# EAGLE schematic controller-ha-v3 (EAGLE 6.5.0)
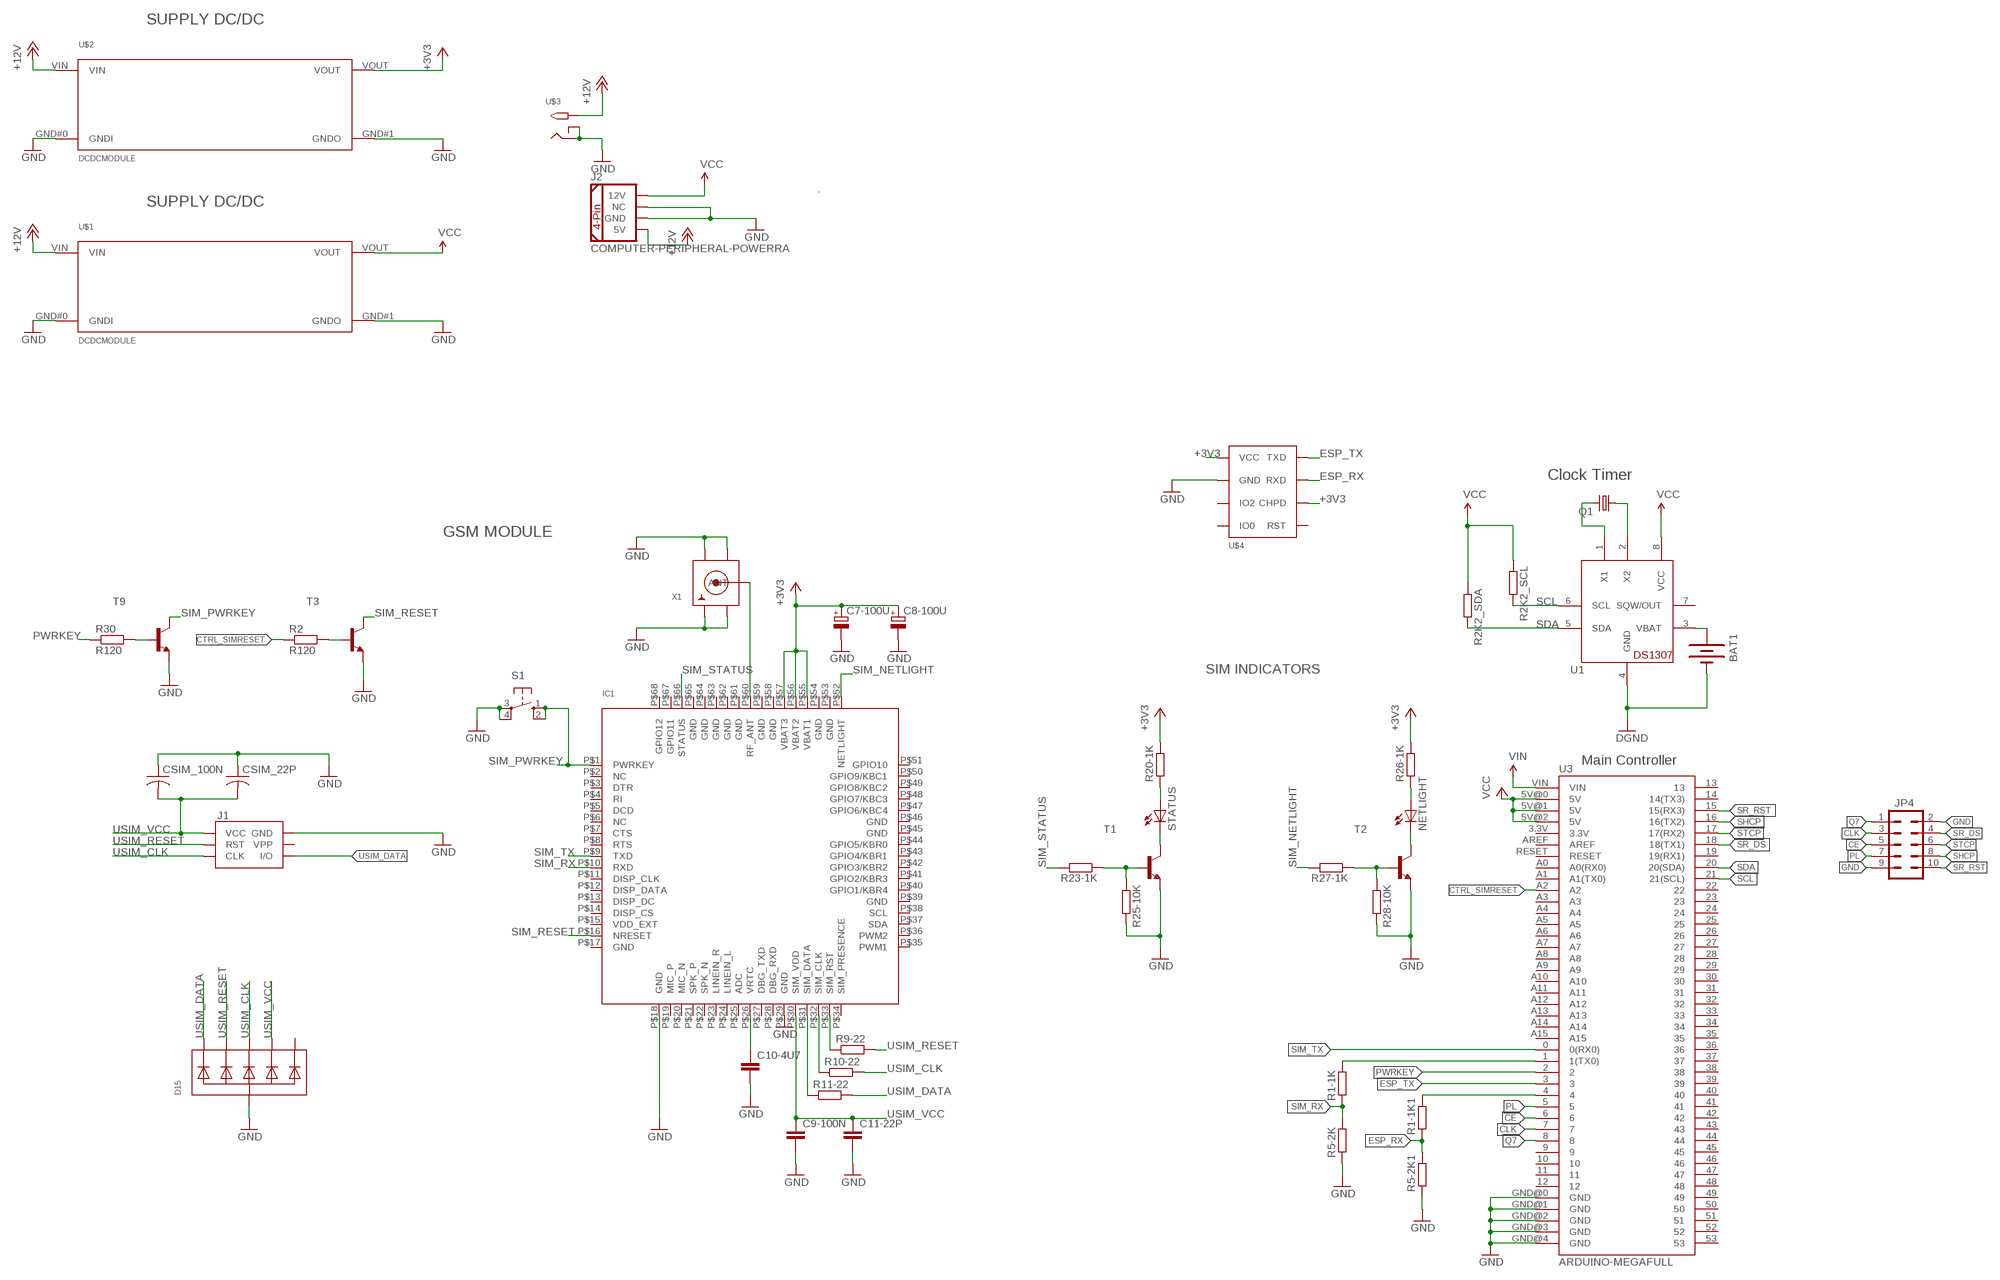
[diagram p0: schematic, sheet 1]

## Parts
BAT1  BATTERY20PTH  [BATTCOM_20MM_PTH]
C7-100U  CPOL-EU153CLV-0605  [153CLV-0605]
C8-100U  CPOL-EU153CLV-0605  [153CLV-0605]
C9-100N  C-EUC0603  [C0603]
C10-4U7  C-EUC0603  [C0603]
C11-22P  C-EUC0603  [C0603]
CSIM_22P  C-USC0603K  [C0603K]
CSIM_100N  C-USC0603K  [C0603K]
D15  TVSARRAY_5LANE  [SOT363]
IC1  GSM_SIM900_LITERAL  [SIM900_SMT]
J1  SIMHOLDERSIM  [SIMHOLDER]
J2  COMPUTER-PERIPHERAL-POWERRA  [COMPUTER-PERIPHERAL-POWER-RA]
JP4  M05X2RA  [2X5-RA]
NETLIGHT  LEDCHIP-LED0805  [CHIP-LED0805]
Q1  CRYSTALTC26H  [TC26H]
R1-1K  R-EU_R0603  [R0603]
R1-1K1  R-EU_R0603  [R0603]
R2  R120  R-EU_M0805  [M0805]
R2K2_SCL  R-EU_R0603  [R0603]
R2K2_SDA  R-EU_R0603  [R0603]
R5-2K  R-EU_R0603  [R0603]
R5-2K1  R-EU_R0603  [R0603]
R9-22  R-EU_R0603  [R0603]
R10-22  R-EU_R0603  [R0603]
R11-22  R-EU_R0603  [R0603]
R20-1K  R-EU_R0603  [R0603]
R23-1K  R-EU_R0603  [R0603]
R25-10K  R-EU_R0603  [R0603]
R26-1K  R-EU_R0603  [R0603]
R27-1K  R-EU_R0603  [R0603]
R28-10K  R-EU_R0603  [R0603]
R30  R120  R-EU_M0805  [M0805]
S1  10-XX  [B3F-10XX]
STATUS  LEDCHIP-LED0805  [CHIP-LED0805]
T1  MMBT2222ALT1-NPN-SOT23-BEC  [SOT23-BEC]
T2  MMBT2222ALT1-NPN-SOT23-BEC  [SOT23-BEC]
T3  MMBT2222ALT1-NPN-SOT23-BEC  [SOT23-BEC]
T9  MMBT2222ALT1-NPN-SOT23-BEC  [SOT23-BEC]
U1  DS1307  [DIL08]
U3  ARDUINO-MEGAFULL  [ARDUINO_MEGA]
U$1  DCDCMODULE  [DCDCMODULE]
U$2  DCDCMODULE  [DCDCMODULE]
U$3  2.1MMJACKTHM  [PJ-102A]
U$4  ESP8266  [ESP8266]
X1  SMACONNECTOR  [SMA90_DIP]

## Nets
+3V3: C7-100U.+ C8-100U.+ IC1.P$55(VBAT1) IC1.P$56(VBAT2) IC1.P$57(VBAT3) R20-1K.2 R26-1K.2 U$2.VOUT U$4.CHPD U$4.VCC
+12V [GND]: J2.5V U$1.VIN U$2.VIN U$3.TIP
CE: JP4.5 U3.6
CLK: JP4.3 U3.7
CTRL_SIMRESET: R2.1 U3.A2
ESP_RX: R1-1K1.1 R5-2K1.2 U$4.RXD
ESP_TX: U3.3 U$4.TXD
GND [GND]: BAT1.2(-) C7-100U.- C8-100U.- C9-100N.2 C10-4U7.2 C11-22P.2 CSIM_22P.1 CSIM_100N.1 D15.2(A) IC1.P$18(GND) IC1.P$29(GND) J1.C5(GND) J2.GND J2.NC JP4.2 JP4.9 R5-2K1.1 R5-2K.1 R25-10K.2 R28-10K.2 S1.3(P) S1.4(P1) T1.E T2.E T3.E T9.E U1.4(GND) U3.GND@0(GND) U3.GND@1(GND) U3.GND@2(GND) U3.GND@3(GND) U3.GND@4(GND) U$1.GND#0(GNDI) U$1.GND#1(GNDO) U$2.GND#0(GNDI) U$2.GND#1(GNDO) U$3.RING U$3.RING_SW U$4.GND X1.GND1 X1.GND2 X1.GND3 X1.GND4 ; supply symbol labelled DGND
N$1: R1-1K.2 U3.1(1(TX0))
N$2: IC1.P$31(SIM_DATA) R11-22.1
N$3: IC1.P$32(SIM_CLK) R10-22.1
N$4: IC1.P$33(SIM_RST) R9-22.1
N$5: C10-4U7.1 IC1.P$26(VRTC)
N$6: IC1.P$60(RF_ANT) X1.ANTENNA(ANT)
N$8: R20-1K.1 STATUS.A
N$9: STATUS.C T1.C
N$10: R23-1K.1 R25-10K.1 T1.B
N$11: NETLIGHT.A R26-1K.1
N$12: NETLIGHT.C T2.C
N$13: R27-1K.1 R28-10K.1 T2.B
N$14: R30.2 T9.B
N$15: R2.2 T3.B
N$16: Q1.1 U1.2(X2)
N$19: Q1.2 U1.1(X1)
N$20: R1-1K1.2 U3.4
N$23: BAT1.1(+) U1.3(VBAT)
PL: JP4.7 U3.5
PWRKEY: R30.1 U3.2
Q7: JP4.1 U3.8
SCL: R2K2_SCL.2 U1.6(SCL) U3.21(21(SCL))
SDA: R2K2_SDA.2 U1.5(SDA) U3.20(20(SDA))
SHCP: JP4.8 U3.16(16(TX2))
SIM_NETLIGHT: IC1.P$52(NETLIGHT) R27-1K.2
SIM_PWRKEY: IC1.P$1(PWRKEY) S1.1(S) S1.2(S1) T9.C
SIM_RESET: IC1.P$16(NRESET) T3.C
SIM_RX: IC1.P$10(RXD) R1-1K.1 R5-2K.2
SIM_STATUS: IC1.P$66(STATUS) R23-1K.2
SIM_TX: IC1.P$9(TXD) U3.0(0(RX0))
SR_DS: JP4.4 U3.18(18(TX1))
SR_RST: JP4.10 U3.15(15(RX3))
STCP: JP4.6 U3.17(17(RX2))
USIM_CLK: D15.4(C3) J1.C3(CLK) R10-22.2
USIM_DATA: D15.1(C1) J1.C7(I/O) R11-22.2
USIM_RESET: D15.3(C2) J1.C2(RST) R9-22.2
USIM_VCC: C9-100N.1 C11-22P.1 CSIM_22P.2 CSIM_100N.2 D15.5(C4) IC1.P$30(SIM_VDD) J1.C1(VCC)
VCC [power]: J2.12V R2K2_SCL.1 R2K2_SDA.1 U1.8(VCC) U3.5V@0(5V) U3.5V@1(5V) U3.5V@2(5V) U$1.VOUT
VIN: U3.VIN
Unconnected: D15.6(C5) IC1.P$2(NC) IC1.P$3(DTR) IC1.P$4(RI) IC1.P$5(DCD) IC1.P$6(NC) IC1.P$7(CTS) IC1.P$8(RTS) IC1.P$11(DISP_CLK) IC1.P$12(DISP_DATA) IC1.P$13(DISP_DC) IC1.P$14(DISP_CS) IC1.P$15(VDD_EXT) IC1.P$19(MIC_P) IC1.P$20(MIC_N) IC1.P$21(SPK_P) IC1.P$22(SPK_N) IC1.P$23(LINEIN_R) IC1.P$24(LINEIN_L) IC1.P$25(ADC) IC1.P$27(DBG_TXD) IC1.P$28(DBG_RXD) IC1.P$34(SIM_PRESENCE) IC1.P$35(PWM1) IC1.P$36(PWM2) IC1.P$37(SDA) IC1.P$38(SCL) IC1.P$40(GPIO1/KBR4) IC1.P$41(GPIO2/KBR3) IC1.P$42(GPIO3/KBR2) IC1.P$43(GPIO4/KBR1) IC1.P$44(GPIO5/KBR0) IC1.P$47(GPIO6/KBC4) IC1.P$48(GPIO7/KBC3) IC1.P$49(GPIO8/KBC2) IC1.P$50(GPIO9/KBC1) IC1.P$51(GPIO10) J1.C6(VPP) U1.7(SQW/OUT) U3.3.3V U3.9 U3.10 U3.11 U3.12 U3.13 U3.14(14(TX3)) U3.19(19(RX1)) U3.22 U3.23 U3.24 U3.25 U3.26 U3.27 U3.28 U3.29 U3.30 U3.31 U3.32 U3.33 U3.34 U3.35 U3.36 U3.37 U3.38 U3.39 U3.40 U3.41 U3.42 U3.43 U3.44 U3.45 U3.46 U3.47 U3.48 U3.49 U3.50 U3.51 U3.52 U3.53 U3.A0(A0(RX0)) U3.A1(A1(TX0)) U3.A3 U3.A4 U3.A5 U3.A6 U3.A7 U3.A8 U3.A9 U3.A10 U3.A11 U3.A12 U3.A13 U3.A14 U3.A15 U3.AREF U3.RESET U$4.IO0 U$4.IO2 U$4.RST

## Notes on the sheet
- SUPPLY DC/DC
- SUPPLY DC/DC
- Clock Timer
- GSM MODULE
- SIM INDICATORS
- Main Controller

## Power pins joined to a net without a drawn wire
GND: IC1.P$17(GND) IC1.P$39(GND) IC1.P$45(GND) IC1.P$46(GND) IC1.P$53(GND) IC1.P$54(GND) IC1.P$58(GND) IC1.P$59(GND) IC1.P$61(GND) IC1.P$62(GND) IC1.P$63(GND) IC1.P$64(GND) IC1.P$65(GND)
GPIO11: IC1.P$67(GPIO11)
GPIO12: IC1.P$68(GPIO12)

## Library data of the parts
BAT1 = SparkFun-Electromechanical:BATTERY: Battery Holders Various common sizes : AA, AAA, 20mm coin cell and 12mm coin cell. 20MM_4LEGS, BATT-10373
C7-100U C8-100U = rcl:CPOL-EU: POLARIZED CAPACITOR, European symbol
C9-100N C10-4U7 C11-22P = rcl:C-EU: CAPACITOR, European symbol
CSIM_22P CSIM_100N = rcl:C-US: CAPACITOR, American symbol
D15 = microbuilder:TVSARRAY_5LANE: Voltage Transient Suppressor Array SOT363 SMF05C - 100W 5V: Digikey - SMF05CT1GOSCT-ND
IC1 = microbuilder:GSM_SIM900_LITERAL: SIM900 Quad-Band GSM/GPRS Module Power Supply: 3.2-4.8V Temperature Range: -30°C-+80°C Bands: GSM 850, EGSM 900, DCS 1800, PCS 1900
J1 = SparkFun-Connectors:SIMHOLDER: SIM Socket Socket for SIM cellular cards. Schematic element and footprint production proven. Spark Fun Electronics SKU : PRT-00548; PROD_ID: CONN-08536
J2 = SparkFun-Connectors:COMPUTER-PERIPHERAL-POWER
JP4 = SparkFun-Connectors:M05X2: Header 5x2 Standard 10-pin dual row 0.1" header. Commonly used with AVR-ISP. Use with Spark Fun Electronics SKU: PRT-00778
NETLIGHT STATUS = adafruit:LED: LED OSRAM: - CHIPLED LG R971, LG N971, LY N971, LG Q971, LY Q971, LO R971, LY R971 LH N974, LH R974 LS Q976, LO Q976, LY Q976 LO Q996 - Hyper CHIPLED LW Q18S LB Q993, LB Q99A, LB R99A - SideLED LS A670, LO A670, LY A670, LG A670, LP A670 LB A673, LV A673, LT A673, LW A673 LH A674 LY A675 LS A676, LA A676, LO A676, LY A676, LW A676 LS A679, LY A679, LG A679 - Hyper Micro SIDELED® LS Y876, LA Y876, LO Y876, LY Y876 LT Y87S - SmartLED LW L88C, LW L88S LB L89C, LB L89S, LG L890 LS L89K, LO L89K, LY L89K LS L896, LA L896, LO L896, LY L896 - TOPLED LS T670, LO T670, LY T670, LG T670, LP T670 LSG T670, LSP T670, LSY T670, LOP T670, LYG T670 LG T671, LOG T671, LSG T671 LB T673, LV T673, LT T673, LW T673 LH T674 LS T676, LA T676, LO T676, LY T676, LB T676, LH T676, LSB T676, LW T676 LB T67C, LV T67C, LT T67C, LS T67K, LO T67K, LY T67K, LW E67C LS E67B, LA E67B, LO E67B, LY E67B, LB E67C, LV E67C, LT E67C LW T67C LS T679, LY T679, LG T679 LS T770, LO T770, LY T770, LG T770, LP T770 LB T773, LV T773, LT T773, LW T773 LH T774 LS E675, LA E675, LY E675, LS T675 LS T776, LA T776, LO T776, LY T776, LB T776 LHGB T686 LT T68C, LB T68C - Hyper Mini TOPLED® LB M676 - Mini TOPLED Santana® LG M470 LS M47K, LO M47K, LY M47K Source: http://www.osram.convergy.de/
Q1 = crystal:CRYSTAL: CRYSTAL; OC_FARNELL: unknown; OC_NEWARK: unknown
R1-1K R1-1K1 R2K2_SCL R2K2_SDA R5-2K R5-2K1 R9-22 R10-22 R11-22 R20-1K R23-1K R25-10K R26-1K R27-1K R28-10K = rcl:R-EU_: RESISTOR, European symbol
R2 R30 = resistor:R-EU_: RESISTOR, European symbol
S1 = switch-omron:10-XX: OMRON SWITCH; MPN: B3F-1000; OC_FARNELL: 176432; OC_NEWARK: 36M3542
T1 T2 = transistor:*-NPN-: NPN Transistror BF959 corrected 2008.03.06
T3 T9 = transistor-neu-to92:*-NPN-: NPN Transistror BF959 corrected 2008.03.06
U1 = adafruit:DS1307: DS1307 Real time clock (RTC) with battery backup ability. Talk to it via i2c
U3 = SparkFun-Boards:ARDUINO-MEGA: Arduino Mega board footprint
U$1 U$2 = bontor:DCDCMODULE
U$3 = adafruit:2.1MMJACK: 2.1mm x 5.5mm THM DC jack with internal switch. Digikey part #PJ-102A, 4UCON part #05537 2.1mm x 5.5mm SMT DC jack with internal switch. Digikey part #PJ-002A-SMT, 4UCON part #03267 By microbuilder.eu & adafruit.com
U$4 = tigorcustom:ESP8266
X1 = microbuilder:SMACONNECTOR: SMA Connector 90° DIP SMA Connector, 50 Ohm (4UConnector: 07259)

## Net classes
1 power: width 0.305 mm, drill 0.6 mm, clearance 0.813 mm
2 GND: width 0.305 mm, drill 0.6 mm, clearance 0.508 mm
3 LIVEAC: width 0.508 mm, drill 0.508 mm, clearance 1.27 mm